# EasyEDA schematic schematic.json
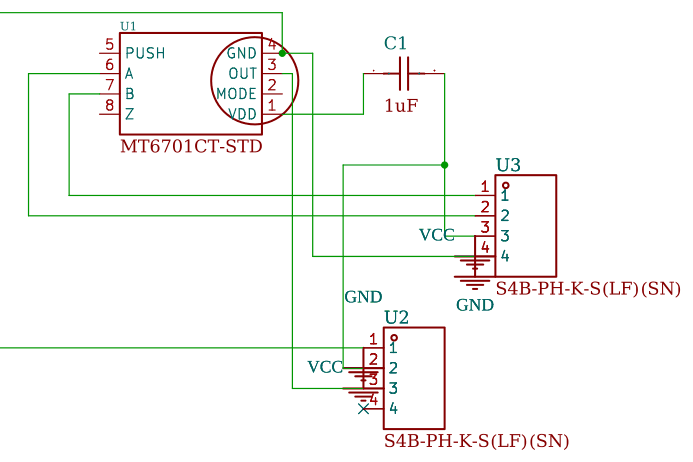
[diagram p0: schematic sheet]

## Parts
C1  1uF  [0]
U1  MT6701CT-STD  [0]
U2  S4B-PH-K-S(LF)(SN)  [0]
U3  S4B-PH-K-S(LF)(SN)  [0]

## Library data of the parts
C1 = -: Symbol: CAP; Device: CAP_0603; Convert to PCB: yes; Add into BOM: yes; Supplier Footprint: 0603
U1 = -: Supplier: LCSC; Supplier Part: C2856764; Manufacturer: MagnTek(麦歌恩); JLCPCB Part Class: Extended Part; LCSC Part Name: 霍尔在线编程角度位置传感器; Supplier Footprint: SOP-8; Datasheet: https://atta.szlcsc.com/upload/public/pdf/source/20210901/89396AA55DF26524CEF7734A3D9C2FB3.pdf; Add into BOM: yes; Convert to PCB: yes
U2 U3 = -: Pins Structure:1x4P Pitch:2mm Mounting Style:Right-Angle Reference Series:PH Number of Pins:4P Number of Rows:1 Number of PINs Per Row:4 Row Spacing:- Current Rating (Max):2A Contact Material:Brass Contact Plating:Tin Operating Temperature Range:-25℃+85℃; Symbol: S4B-PH-K-S-(LF)(SN); LCSC Part Name: 1x4P 间距:2mm 弯插 系列:PH; Supplier Part: C157926; Manufacturer: JST; Supplier Footprint: 弯插,P=2mm; JLCPCB Part Class: Extended Part; Datasheet: https://atta.szlcsc.com/upload/public/pdf/source/20181010/C265101_22107ACC4D8714694FDA2DD97145FA81.pdf; Supplier: LCSC; Add into BOM: yes; Convert to PCB: yes; Pins Structure: 1x4P; Pitch: 2mm; Mounting Style: Right-Angle; Reference Series: PH; Number of Pins: 4P; Number of Rows: 1; Number of PINs Per Row: 4; Current Rating (Max): 2A; Contact Material: Brass; Contact Plating: Tin; Operating Temperature Range: -25℃+85℃; Rated Voltage (Max): 100V; Plastic Material: PA66; Flame Retardant Rating: UL94V-0; Supplementary Features: 打K脚; Colour: White; Z-Height of the Board: 4.8mm; X-Length of Bottom Edge on Board (Spacing Line): 9.9mm; Y-Width of Bottom Edge on Board: 7.6mm

## Nets
GND: U1.4(GND) U2.1 U3.4
VCC: C1.2 U2.2 U3.3
Net-(C1-1): C1.1 U1.1(VDD)
Net-(U1-3): U1.3(OUT) U2.3
Net-(U1-6): U1.6(A) U3.2
Net-(U1-7): U1.7(B) U3.1

Not connected (* = marked no-connect by the designer): U1 2(MODE) 5(PUSH) 8(Z); U2 4*

## Notes on the sheet
- 1
- 2
- 3
- 4
- 5
- 6
- A
- A
- B
- B
- C
- C
- Schematic1
- Update Date
- 2024-07-19
- Schematic
- Create Date
- 2024-07-19
- P1
- Page
- Part Number
- JLCPCB-002
- Drawn
- EasyEDA
- Mt6701_V4
- D
- Reviewed
- EasyEDA
- D
- VER
- SIZE
- PAGE
- 1
- OF
- 1
- V0.1
- A4
- EasyEDA.com
- 1
- 2
- 3
- 4
- 5
- 6
